# Altium project SVPX_FMC_6U_SOM.PrjPcb (part 5 of 5)

## Sheet LVDS_Splitter.SchDoc
size A3; Organization: Altium Limited; Address1: L3, 12a Rodborough Rd; Address2: Frenchs Forest; Address3: NSW; Address4: Australia 2086
Used 2 times, as channels U_LVDS_Splitter, U_LVDS_Splitter. Parts and nets are listed once, with the designators drawn on the sheet.
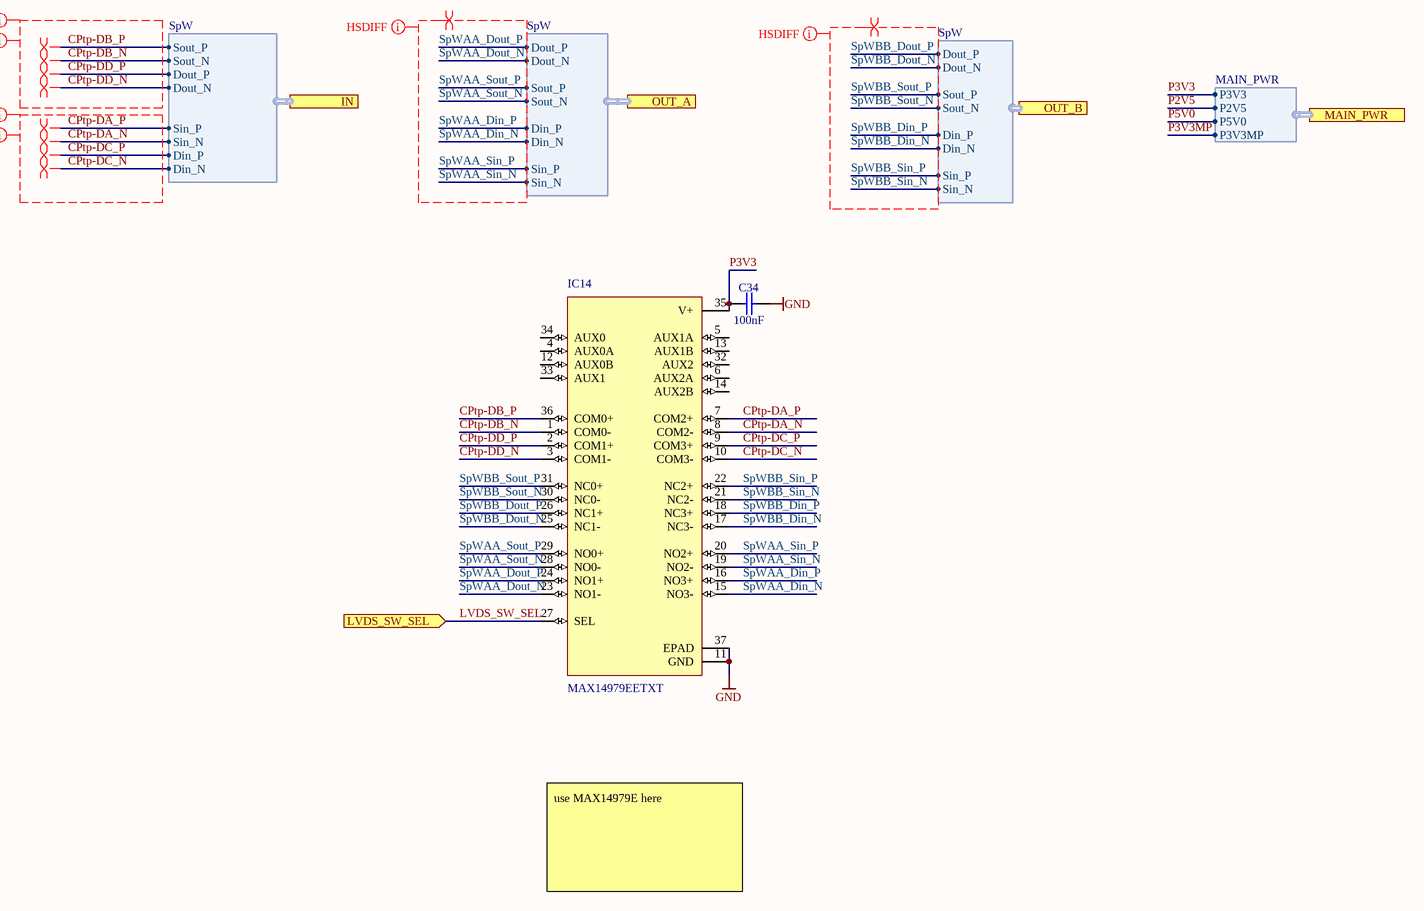
[diagram p17: LVDS_Splitter.SchDoc]

### Parts
C34  100nF  [CAPC0603X33N]
IC14  MAX14979EETXT  [QFN50P600X600X90-37N-S425]

### Ports
IN (harness SpW), LVDS_SW_SEL (in), MAIN_PWR (harness MAIN_PWR), OUT_A (harness SpW), OUT_B (harness SpW)

### Harnesses
MAIN_PWR: P3V3, P2V5, P5V0, P3V3MP
SpW: Sout_P, Sout_N, Dout_P, Dout_N, Sin_P, Sin_N, Din_P, Din_N

### Nets
GND: C34.2 IC14.11(GND) IC14.37(EPAD)
CPtp-DA_N: IC14.8(COM2-) ; port IN.Sin_N
CPtp-DA_P: IC14.7(COM2+) ; port IN.Sin_P
CPtp-DB_N: IC14.1(COM0-) ; port IN.Sout_N
CPtp-DB_P: IC14.36(COM0+) ; port IN.Sout_P
CPtp-DC_N: IC14.10(COM3-) ; port IN.Din_N
CPtp-DC_P: IC14.9(COM3+) ; port IN.Din_P
CPtp-DD_N: IC14.3(COM1-) ; port IN.Dout_N
CPtp-DD_P: IC14.2(COM1+) ; port IN.Dout_P
LVDS_SW_SEL: IC14.27(SEL) ; port LVDS_SW_SEL
P2V5: port MAIN_PWR.P2V5
P3V3: C34.1 IC14.35(V+) ; port MAIN_PWR.P3V3
P3V3MP: port MAIN_PWR.P3V3MP
P5V0: port MAIN_PWR.P5V0
SpWAA_Din_N: IC14.15(NO3-) ; port OUT_A.Din_N
SpWAA_Din_P: IC14.16(NO3+) ; port OUT_A.Din_P
SpWAA_Dout_N: IC14.23(NO1-) ; port OUT_A.Dout_N
SpWAA_Dout_P: IC14.24(NO1+) ; port OUT_A.Dout_P
SpWAA_Sin_N: IC14.19(NO2-) ; port OUT_A.Sin_N
SpWAA_Sin_P: IC14.20(NO2+) ; port OUT_A.Sin_P
SpWAA_Sout_N: IC14.28(NO0-) ; port OUT_A.Sout_N
SpWAA_Sout_P: IC14.29(NO0+) ; port OUT_A.Sout_P
SpWBB_Din_N: IC14.17(NC3-) ; port OUT_B.Din_N
SpWBB_Din_P: IC14.18(NC3+) ; port OUT_B.Din_P
SpWBB_Dout_N: IC14.25(NC1-) ; port OUT_B.Dout_N
SpWBB_Dout_P: IC14.26(NC1+) ; port OUT_B.Dout_P
SpWBB_Sin_N: IC14.21(NC2-) ; port OUT_B.Sin_N
SpWBB_Sin_P: IC14.22(NC2+) ; port OUT_B.Sin_P
SpWBB_Sout_N: IC14.30(NC0-) ; port OUT_B.Sout_N
SpWBB_Sout_P: IC14.31(NC0+) ; port OUT_B.Sout_P

Not connected (* = marked no-connect by the designer): IC14 4(AUX0A) 5(AUX1A) 6(AUX2A) 12(AUX0B) 13(AUX1B) 14(AUX2B) 32(AUX2) 33(AUX1) 34(AUX0)

### Channels
U_LVDS_Splitter: designators end in A; ports LVDS_SW_SEL=LVDS_SW_SEL
U_LVDS_Splitter: designators end in B; ports LVDS_SW_SEL=LVDS_SW_SEL

### Layout directives
differential pair: CPtp-DA_N, CPtp-DA_P, CPtp-DB_N, CPtp-DB_P, CPtp-DC_N, CPtp-DC_P, CPtp-DD_N, CPtp-DD_P, SpWAA_Din_N, SpWAA_Din_P, SpWAA_Dout_N, SpWAA_Dout_P, SpWAA_Sin_N, SpWAA_Sin_P, SpWAA_Sout_N, SpWAA_Sout_P, SpWBB_Din_N, SpWBB_Din_P, SpWBB_Dout_N, SpWBB_Dout_P, SpWBB_Sin_N, SpWBB_Sin_P, SpWBB_Sout_N, SpWBB_Sout_P
net class SpW_02_out: CPtp-DB_N, CPtp-DB_P, CPtp-DD_N, CPtp-DD_P
net class SpW_02_in: CPtp-DA_N, CPtp-DA_P, CPtp-DC_N, CPtp-DC_P
net class HSDIFF: CPtp-DA_N, CPtp-DA_P, CPtp-DB_N, CPtp-DB_P, CPtp-DC_N, CPtp-DC_P, CPtp-DD_N, CPtp-DD_P, SpWAA_Din_N, SpWAA_Din_P, SpWAA_Dout_N, SpWAA_Dout_P, SpWAA_Sin_N, SpWAA_Sin_P, SpWAA_Sout_N, SpWAA_Sout_P, SpWBB_Din_N, SpWBB_Din_P, SpWBB_Dout_N, SpWBB_Dout_P, SpWBB_Sin_N, SpWBB_Sin_P, SpWBB_Sout_N, SpWBB_Sout_P

### Notes on the sheet
- use MAX14979E here
- Title
- Size:
- Date:
- A3
- Number:
- Time:
- Revision:
- Sheet
- of
- File:

### Library data of the parts
C34 = CC0201_100NF_6.3V_10%_X5R: Non-polarised capacitor; Manufacturer: GENERIC; Part Description: SMD Multilayer Chip Ceramic Capacitor; Manufacturer1 Part Number: 02016D104KAT2A; Tolerance: ±10%; Voltage: 6.3V; TC: X5R; Part Number: CC0201_100NF_6.3V_10%_X5R; Component Kind: Standard; Component Type: Standard; Pin Count: 2; Value: 100nF; Status: Not Recommended; Manufacturer Part Number: CC0201_100NF_6.3V_10%_X5R; Case: 0201; Mounted: Yes; Socket: No; SMD: Yes; Sense: No; Manufacturer1 Example: AVX; Manufacturer1 ComponentHeight: 0.33mm; HelpURL: \\cern.ch\dfs\Applications\Altium\Datasheets\CC0201_X5R_AVX.pdf; Author: CERN DEM JLC; CreateDate: 03/12/2007; LatestRevisionDate: 03/12/2007
IC14 = MAX14979EETXT: IC SWITCH HIGH BW LVDS 36TQFN; MF: Maxim Integrated; MP: MAX14979EETX+; SnapEDA_Link: https://www.snapeda.com/parts/MAX14979EETX%2B/Maxim%20Integrated/view-part/?ref=snap; Price: None; Package: QFN-36 Maxim; Availability: Unavailable; Value: *

## Sheet MISC_Protection.SchDoc
size A4
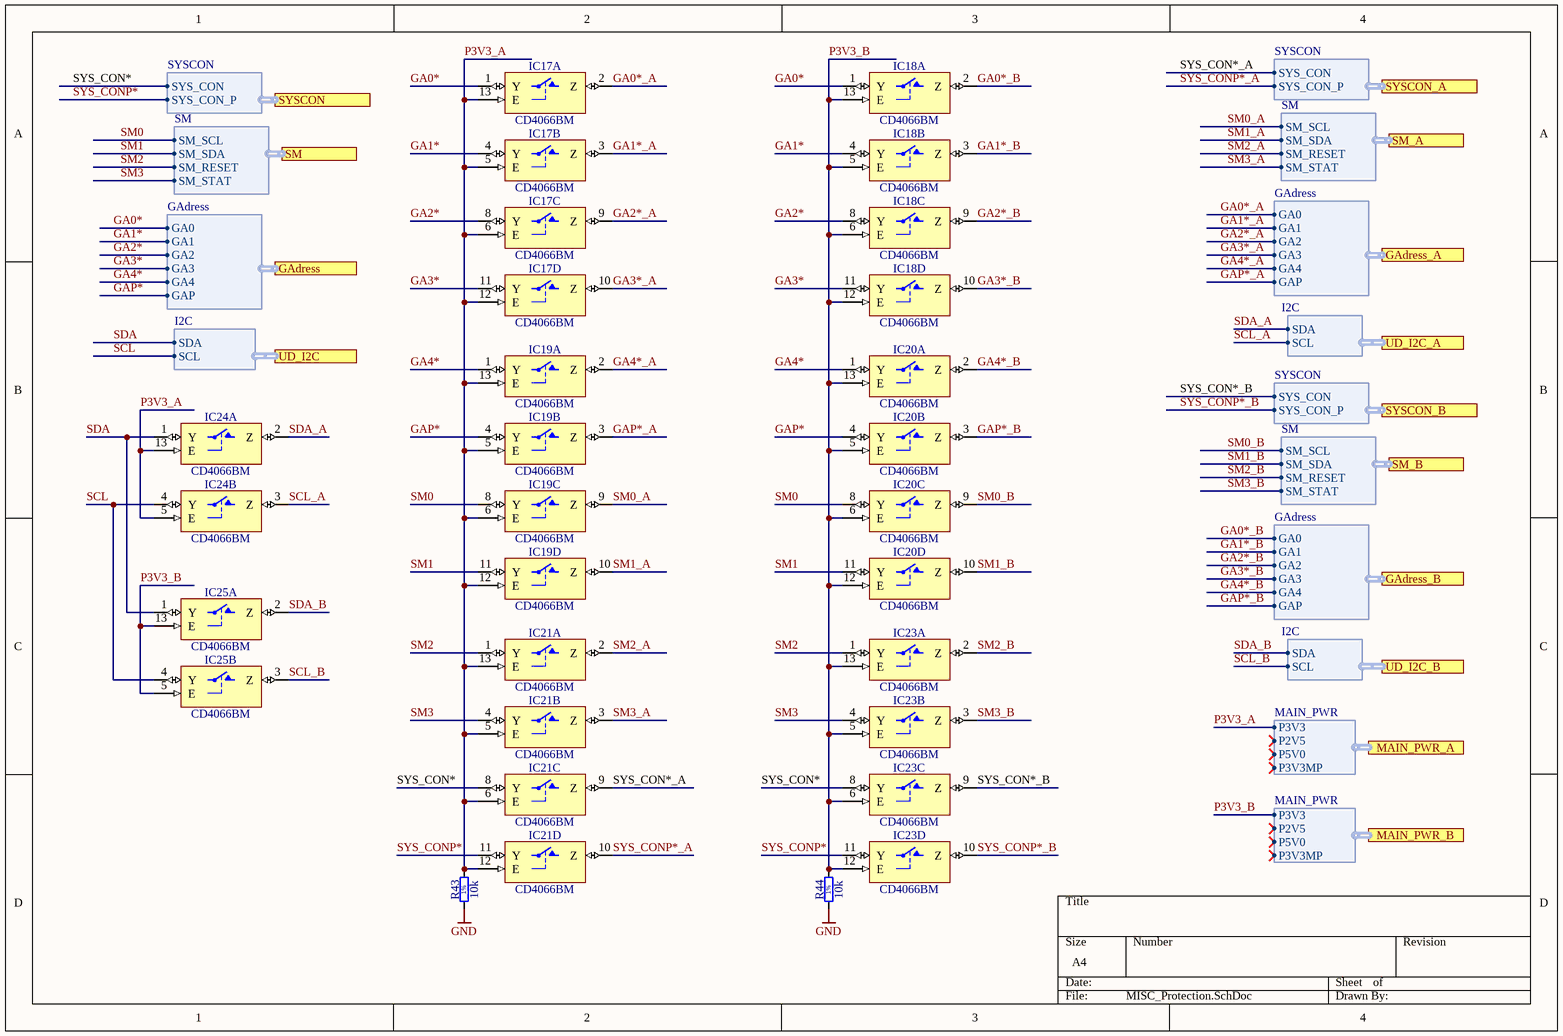
[diagram p18: MISC_Protection.SchDoc]

### Parts
IC17  CD4066BM  [SOIC127P600X175-14N]  (parts A,B,C,D of 4)
IC18  CD4066BM  [SOIC127P600X175-14N]  (parts A,B,C,D of 4)
IC19  CD4066BM  [SOIC127P600X175-14N]  (parts A,B,C,D of 4)
IC20  CD4066BM  [SOIC127P600X175-14N]  (parts A,B,C,D of 4)
IC21  CD4066BM  [SOIC127P600X175-14N]  (parts A,B,C,D of 4)
IC23  CD4066BM  [SOIC127P600X175-14N]  (parts A,B,C,D of 4)
IC24  CD4066BM  [SOIC127P600X175-14N]  (parts A,B of 4)
IC25  CD4066BM  [SOIC127P600X175-14N]  (parts A,B of 4)
R43  10k  [RESC1005X40N]
R44  10k  [RESC1005X40N]

### Ports
GAdress (harness GAdress), GAdress_A (harness GAdress), GAdress_B (harness GAdress), MAIN_PWR_A (harness MAIN_PWR), MAIN_PWR_B (harness MAIN_PWR), SM (harness SM), SM_A (harness SM), SM_B (harness SM), SYSCON (harness SYSCON), SYSCON_A (harness SYSCON), SYSCON_B (harness SYSCON), UD_I2C (harness I2C), UD_I2C_A (harness I2C), UD_I2C_B (harness I2C)

### Harnesses
SYSCON: SYS_CON, SYS_CON_P
SM: SM_SCL, SM_SDA, SM_RESET, SM_STAT
GAdress: GA0, GA1, GA2, GA3, GA4, GAP
MAIN_PWR: P3V3, P2V5, P5V0, P3V3MP
I2C: SDA, SCL

### Nets
GND: IC17.7(VSS) IC18.7(VSS) IC19.7(VSS) IC20.7(VSS) IC21.7(VSS) IC23.7(VSS) IC24.7(VSS) IC25.7(VSS) R43.1 R44.1
VDD: IC17.14(VDD) IC18.14(VDD) IC19.14(VDD) IC20.14(VDD) IC21.14(VDD) IC23.14(VDD) IC24.14(VDD) IC25.14(VDD)
GA0*: IC17.1(Y) IC18.1(Y) ; port GAdress.GA0
GA0*_A: IC17.2(Z) ; port GAdress_A.GA0  [project net GA0]
GA0*_B: IC18.2(Z) ; port GAdress_B.GA0  [project net GA0]
GA1*: IC17.4(Y) IC18.4(Y) ; port GAdress.GA1
GA1*_A: IC17.3(Z) ; port GAdress_A.GA1  [project net GA1]
GA1*_B: IC18.3(Z) ; port GAdress_B.GA1  [project net GA1]
GA2*: IC17.8(Y) IC18.8(Y) ; port GAdress.GA2
GA2*_A: IC17.9(Z) ; port GAdress_A.GA2  [project net GA2]
GA2*_B: IC18.9(Z) ; port GAdress_B.GA2  [project net GA2]
GA3*: IC17.11(Y) IC18.11(Y) ; port GAdress.GA3
GA3*_A: IC17.10(Z) ; port GAdress_A.GA3  [project net GA3]
GA3*_B: IC18.10(Z) ; port GAdress_B.GA3  [project net GA3]
GA4*: IC19.1(Y) IC20.1(Y) ; port GAdress.GA4
GA4*_A: IC19.2(Z) ; port GAdress_A.GA4  [project net GA4]
GA4*_B: IC20.2(Z) ; port GAdress_B.GA4  [project net GA4]
GAP*: IC19.4(Y) IC20.4(Y) ; port GAdress.GAP
GAP*_A: IC19.3(Z) ; port GAdress_A.GAP  [project net GAP]
GAP*_B: IC20.3(Z) ; port GAdress_B.GAP  [project net GAP]
P3V3_A: IC17.5(E) IC17.6(E) IC17.12(E) IC17.13(E) IC19.5(E) IC19.6(E) IC19.12(E) IC19.13(E) IC21.5(E) IC21.6(E) IC21.12(E) IC21.13(E) IC24.5(E) IC24.13(E) R43.2 ; port MAIN_PWR_A.P3V3  [project net MAIN_PWR.P3V3]
P3V3_B: IC18.5(E) IC18.6(E) IC18.12(E) IC18.13(E) IC20.5(E) IC20.6(E) IC20.12(E) IC20.13(E) IC23.5(E) IC23.6(E) IC23.12(E) IC23.13(E) IC25.5(E) IC25.13(E) R44.2 ; port MAIN_PWR_B.P3V3  [project net MAIN_PWR.P3V3]
SCL: IC24.4(Y) IC25.4(Y) ; port UD_I2C.SCL
SCL_A: IC24.3(Z) ; port UD_I2C_A.SCL
SCL_B: IC25.3(Z) ; port UD_I2C_B.SCL
SDA: IC24.1(Y) IC25.1(Y) ; port UD_I2C.SDA
SDA_A: IC24.2(Z) ; port UD_I2C_A.SDA
SDA_B: IC25.2(Z) ; port UD_I2C_B.SDA
SM0: IC19.8(Y) IC20.8(Y) ; port SM.SM_SCL
SM0_A: IC19.9(Z) ; port SM_A.SM_SCL
SM0_B: IC20.9(Z) ; port SM_B.SM_SCL
SM1: IC19.11(Y) IC20.11(Y) ; port SM.SM_SDA
SM1_A: IC19.10(Z) ; port SM_A.SM_SDA
SM1_B: IC20.10(Z) ; port SM_B.SM_SDA
SM2: IC21.1(Y) IC23.1(Y) ; port SM.SM_RESET
SM2_A: IC21.2(Z) ; port SM_A.SM_RESET
SM2_B: IC23.2(Z) ; port SM_B.SM_RESET
SM3: IC21.4(Y) IC23.4(Y) ; port SM.SM_STAT
SM3_A: IC21.3(Z) ; port SM_A.SM_STAT
SM3_B: IC23.3(Z) ; port SM_B.SM_STAT
SYS_CON*: IC21.8(Y) IC23.8(Y) ; port SYSCON.SYS_CON
SYS_CON*_A: IC21.9(Z) ; port SYSCON_A.SYS_CON  [project net SYS_CON]
SYS_CON*_B: IC23.9(Z) ; port SYSCON_B.SYS_CON  [project net SYS_CON]
SYS_CONP*: IC21.11(Y) IC23.11(Y) ; port SYSCON.SYS_CON_P
SYS_CONP*_A: IC21.10(Z) ; port SYSCON_A.SYS_CON_P  [project net SYS_CON_P]
SYS_CONP*_B: IC23.10(Z) ; port SYSCON_B.SYS_CON_P  [project net SYS_CON_P]

### Notes on the sheet
- (in symbol R0402_10K_1%_0.0625W_100PPM) 1%

### Library data of the parts
IC17-IC21 IC23-IC25 = CD4066BM: Part Description: CMOS Quad Bilateral Switch; Manufacturer: TEXAS INSTRUMENTS; PressFit: No; Bonding: No; Part Number: CD4066BM; Component Kind: Standard; Component Type: Standard; Device: CD4066BM; PackageDescription: SOIC 14, Pitch 1.27mm - Body 4x8.75mm, IPC Medium Density; Manufacturer Part Number: CD4066BM; Pin Count: 14; Case: SOIC14; Mounted: Yes; Socket: No; SMD: Yes; Sense: No; ComponentHeight: 1.75mm; Author: CERN DEM MR; HelpURL: \\cern.ch\dfs\Applications\Altium\Datasheets\CD4066BM.pdf; CreateDate: 21.01.2016; LatestRevisionDate: 21.01.2016
R43 R44 = R0402_10K_1%_0.0625W_100PPM: Resistor - 1%; Part Description: General Purpose Thick Film Chip Resistor; Manufacturer: GENERIC; Manufacturer1 Part Number: 232270671003L; TC: ±100ppm/°C; PressFit: No; Part Number: R0402_10K_1%_0.0625W_100PPM; Component Kind: Standard; Component Type: Standard; Pin Count: 2; Value: 10k; Status: Not Recommended; Power: 0.0625W; Tolerance: ±1%; Manufacturer Part Number: R0402_10K_1%_0.0625W_100PPM; Case: 0402; Mounted: Yes; Sense: No; Socket: No; SMD: Yes; Manufacturer1 Example: YAGEO PHYCOMP; Manufacturer1 ComponentHeight: 0.4mm; HelpURL: \\cern.ch\dfs\Applications\Altium\Datasheets\R0402_Phycomp_RC0402.pdf; Author: CERN DEM JLC; CreateDate: 03/12/2007; LatestRevisionDate: 17/10/2012

## Nets that join several sheets
3.3V_AUX: Supply for FPGA, FMC and SDRAM (C204A.2 IC2A.3 IC2A.4 R64A.1), SLT3-PAY-1Q2T_P0 (C174.2 P0.D5), Supply for FPGA, FMC and SDRAM (C204B.2 IC2B.3 IC2B.4 R64B.1)
GND: SVPXFMC_Carrier_6U_SOM (8 pins), Interface_prot_A (C2A.2 C230A.2 IC1A.11), U_FMC_connector (175 pins), Supply for FPGA, FMC and SDRAM (85 pins), SLT3-PAY-1Q2T_P0 (14 pins), SLT3-PAY-1Q2T_P1 (41 pins), U_management (12 pins), U_management/U_NIC_MSP430_power_jtag (17 pins), WR_OSC (17 pins), SoM (60 pins), U_FPGA_Config (13 pins), Interface_prot_A (C2B.2 C230B.2 IC1B.11), U_FMC_connector (176 pins), Supply for FPGA, FMC and SDRAM (85 pins), U_management (12 pins), U_management/U_NIC_MSP430_power_jtag (17 pins), WR_OSC (17 pins), SoM (60 pins), U_FPGA_Config (13 pins), U_LVDS_Splitter (C34A.2 IC14A.11 IC14A.37), U_LVDS_Splitter (C34B.2 IC14B.11 IC14B.37), MISC_Protection (10 pins)
P3V3_buck: Supply for FPGA, FMC and SDRAM (10 pins), Supply for FPGA, FMC and SDRAM (10 pins)
P12V0_IN: Supply for FPGA, FMC and SDRAM (C74A.2 IC4A.3 IC6A.1 IC9A.1), Supply for FPGA, FMC and SDRAM (C74B.2 IC4B.3 IC6B.1 IC9B.1)
3P3V: U_FMC_connector (8 pins), Supply for FPGA, FMC and SDRAM (L10A.2)
3P3V: U_FMC_connector (8 pins), Supply for FPGA, FMC and SDRAM (L10B.2)
3P3VAUX: U_FMC_connector (C193A.2 J2A.d32), Supply for FPGA, FMC and SDRAM (L3A.2)
3P3VAUX: U_FMC_connector (C193B.2 J2B.d32), Supply for FPGA, FMC and SDRAM (L3B.2)
12P0V: U_FMC_connector (5 pins), Supply for FPGA, FMC and SDRAM (L8A.2)
12P0V: U_FMC_connector (5 pins), Supply for FPGA, FMC and SDRAM (L8B.2)
CPtp-DA_N: SLT3-PAY-1Q2T_P1 (P1.B13), U_LVDS_Splitter (IC14B.8)
CPtp-DA_N: SLT3-PAY-1Q2T_P1 (P1.B15), U_LVDS_Splitter (IC14A.8)
CPtp-DA_P: SLT3-PAY-1Q2T_P1 (P1.A13), U_LVDS_Splitter (IC14B.7)
CPtp-DA_P: SLT3-PAY-1Q2T_P1 (P1.A15), U_LVDS_Splitter (IC14A.7)
CPtp-DB_N: SLT3-PAY-1Q2T_P1 (P1.E13), U_LVDS_Splitter (IC14B.1)
CPtp-DB_N: SLT3-PAY-1Q2T_P1 (P1.E15), U_LVDS_Splitter (IC14A.1)
CPtp-DB_P: SLT3-PAY-1Q2T_P1 (P1.D13), U_LVDS_Splitter (IC14B.36)
CPtp-DB_P: SLT3-PAY-1Q2T_P1 (P1.D15), U_LVDS_Splitter (IC14A.36)
CPtp-DC_N: SLT3-PAY-1Q2T_P1 (P1.C14), U_LVDS_Splitter (IC14B.10)
CPtp-DC_N: SLT3-PAY-1Q2T_P1 (P1.C16), U_LVDS_Splitter (IC14A.10)
CPtp-DC_P: SLT3-PAY-1Q2T_P1 (P1.B14), U_LVDS_Splitter (IC14B.9)
CPtp-DC_P: SLT3-PAY-1Q2T_P1 (P1.B16), U_LVDS_Splitter (IC14A.9)
CPtp-DD_N: SLT3-PAY-1Q2T_P1 (P1.F14), U_LVDS_Splitter (IC14B.3)
CPtp-DD_N: SLT3-PAY-1Q2T_P1 (P1.F16), U_LVDS_Splitter (IC14A.3)
CPtp-DD_P: SLT3-PAY-1Q2T_P1 (P1.E14), U_LVDS_Splitter (IC14B.2)
CPtp-DD_P: SLT3-PAY-1Q2T_P1 (P1.E16), U_LVDS_Splitter (IC14A.2)
DIS_LVDS: Supply for FPGA, FMC and SDRAM (R85A.2 T3A.3), SoM (5 pins)
DIS_LVDS: Supply for FPGA, FMC and SDRAM (R85B.2 T3B.3), SoM (5 pins)
EN_IFC: Interface_prot_A (IC1A.10), Supply for FPGA, FMC and SDRAM (D7A.2 R110A.1)
EN_IFC: Interface_prot_A (IC1B.10), Supply for FPGA, FMC and SDRAM (D7B.2 R110B.1)
EXT_RST_1: U_management (IC31A#1.53), U_FPGA_Config (C206A.2)
EXT_RST_1: U_management (IC31B#1.53), U_FPGA_Config (C206B.2)
FMC_P12V0_MSP430: Supply for FPGA, FMC and SDRAM (R63A.1), U_management (IC31A#1.36)
FMC_P12V0_MSP430: Supply for FPGA, FMC and SDRAM (R63B.1), U_management (IC31B#1.36)
FMC_P12V0_ONn: Supply for FPGA, FMC and SDRAM (IC9A.4 R63A.2 R83A.2), SoM (JB1A.100)
FMC_P12V0_ONn: Supply for FPGA, FMC and SDRAM (IC9B.4 R63B.2 R83B.2), SoM (JB1B.100)
FMC_P12V0_OVCn: Supply for FPGA, FMC and SDRAM (IC9A.7 R81A.2), U_management (IC31A#1.58)
FMC_P12V0_OVCn: Supply for FPGA, FMC and SDRAM (IC9B.7 R81B.2), U_management (IC31B#1.58)
FMC_SCL: U_FMC_connector (J2A.c30), SoM (IC13A.20 R35A.1)
FMC_SCL: U_FMC_connector (J2B.c30), SoM (IC13B.20 R35B.1)
FMC_SDA: U_FMC_connector (J2A.c31), SoM (IC13A.18 R37A.1)
FMC_SDA: U_FMC_connector (J2B.c31), SoM (IC13B.18 R37B.1)
GA0: U_management (IC31A#1.44 R130A.1), MISC_Protection (IC18.2)
GA0: U_management (IC31B#1.44 R130B.1), MISC_Protection (IC17.2)
GA0*: SLT3-PAY-1Q2T_P0 (P0.A6), MISC_Protection (IC17.1 IC18.1)
GA1: U_management (IC31A#1.45 R131A.1), MISC_Protection (IC18.3)
GA1: U_management (IC31B#1.45 R131B.1), MISC_Protection (IC17.3)
GA1*: SLT3-PAY-1Q2T_P0 (P0.B6), MISC_Protection (IC17.4 IC18.4)
GA2: U_management (IC31A#1.46 R132A.1), MISC_Protection (IC18.9)
GA2: U_management (IC31B#1.46 R132B.1), MISC_Protection (IC17.9)
GA2*: SLT3-PAY-1Q2T_P0 (P0.F6), MISC_Protection (IC17.8 IC18.8)
GA3: U_management (IC31A#1.47 R133A.1), MISC_Protection (IC18.10)
GA3: U_management (IC31B#1.47 R133B.1), MISC_Protection (IC17.10)
GA3*: SLT3-PAY-1Q2T_P0 (P0.G6), MISC_Protection (IC17.11 IC18.11)
GA4: U_management (IC31A#1.48 R134A.1), MISC_Protection (IC20.2)
GA4: U_management (IC31B#1.48 R134B.1), MISC_Protection (IC19.2)
GA4*: SLT3-PAY-1Q2T_P0 (P0.F5), MISC_Protection (IC19.1 IC20.1)
GAP: U_management (IC31A#1.49 R135A.1), MISC_Protection (IC20.3)
GAP: U_management (IC31B#1.49 R135B.1), MISC_Protection (IC19.3)
GAP*: SLT3-PAY-1Q2T_P0 (P0.G5), MISC_Protection (IC19.4 IC20.4)
GBTCLK0_M2C_N: U_FMC_connector (J2A.d5), SoM (JB3A.33)
GBTCLK0_M2C_N: U_FMC_connector (J2B.d5), SoM (JB3B.33)
GBTCLK0_M2C_P: U_FMC_connector (J2A.d4), SoM (JB3A.31)
GBTCLK0_M2C_P: U_FMC_connector (J2B.d4), SoM (JB3B.31)
GPIO_A1: Interface_prot_A (IC1A.6), U_management (IC31A#1.41)
GPIO_A1: Interface_prot_A (IC1B.6), U_management (IC31B#1.41)
GPIO_A2: Interface_prot_A (IC1A.7), U_management (IC31A#1.42)
GPIO_A2: Interface_prot_A (IC1B.7), U_management (IC31B#1.42)
GPIO_A3: Interface_prot_A (IC1A.8), U_management (IC31A#1.43)
GPIO_A3: Interface_prot_A (IC1B.8), U_management (IC31B#1.43)
GPIO_A4: Interface_prot_A (IC1A.9), U_management (IC31A#1.35)
GPIO_A4: Interface_prot_A (IC1B.9), U_management (IC31B#1.35)
GPIO_S1: Interface_prot_A (IC1A.15), SoM (JB3A.38)
GPIO_S1: Interface_prot_A (IC1B.15), SoM (JB3B.38)
GPIO_S2: Interface_prot_A (IC1A.14), SoM (JB3A.40)
GPIO_S2: Interface_prot_A (IC1B.14), SoM (JB3B.40)
GPIO_S3: Interface_prot_A (IC1A.13), SoM (JB3A.42)
GPIO_S3: Interface_prot_A (IC1B.13), SoM (JB3B.42)
GPIO_S4: Interface_prot_A (IC1A.12), SoM (JB3A.44)
GPIO_S4: Interface_prot_A (IC1B.12), SoM (JB3B.44)
Helper_DCXO_N: WR_OSC (C195A.2 R122A.1 R127A.2), SoM (JB2A.22)
Helper_DCXO_N: WR_OSC (C195B.2 R122B.1 R127B.2), SoM (JB2B.22)
Helper_DCXO_OE: WR_OSC (R124A.1 R129A.1), SoM (JB3A.60)
Helper_DCXO_OE: WR_OSC (R124B.1 R129B.1), SoM (JB3B.60)
Helper_DCXO_P: WR_OSC (C194A.2 R123A.1 R128A.2), SoM (JB2A.24)
Helper_DCXO_P: WR_OSC (C194B.2 R123B.1 R128B.2), SoM (JB2B.24)
Helper_DCXO_SCL: WR_OSC (OSC2A.8 R121A.1 TP8A.1), SoM (JB3A.58 R33A.1)
Helper_DCXO_SCL: WR_OSC (OSC2B.8 R121B.1 TP8B.1), SoM (JB3B.58 R33B.1)
Helper_DCXO_SDA: WR_OSC (OSC2A.7 R120A.1 TP7A.1), SoM (JB3A.56 R31A.1)
Helper_DCXO_SDA: WR_OSC (OSC2B.7 R120B.1 TP7B.1), SoM (JB3B.56 R31B.1)
Imeas_P2V5: Supply for FPGA, FMC and SDRAM (C25A.2 IC7A.8 R26A.1), U_management (IC31A#1.31)
Imeas_P2V5: Supply for FPGA, FMC and SDRAM (C25B.2 IC7B.8 R26B.1), U_management (IC31B#1.31)
Imeas_P3V3: Supply for FPGA, FMC and SDRAM (C26A.2 IC7A.10 R27A.1), U_management (IC31A#1.29)
Imeas_P3V3: Supply for FPGA, FMC and SDRAM (C26B.2 IC7B.10 R27B.1), U_management (IC31B#1.29)
Imeas_P3V3MP: Supply for FPGA, FMC and SDRAM (C205A.2 R97A.1), U_management (IC31A#1.63)
Imeas_P3V3MP: Supply for FPGA, FMC and SDRAM (C205B.2 R97B.1), U_management (IC31B#1.63)
Imeas_P5V0: Supply for FPGA, FMC and SDRAM (C22A.2 IC7A.4 R47A.1), U_management (IC31A#1.17)
Imeas_P5V0: Supply for FPGA, FMC and SDRAM (C22B.2 IC7B.4 R47B.1), U_management (IC31B#1.17)
Imeas_P12V0: Supply for FPGA, FMC and SDRAM (C75A.2 R45A.1), U_management (IC31A#1.30)
Imeas_P12V0: Supply for FPGA, FMC and SDRAM (C75B.2 R45B.1), U_management (IC31B#1.30)
LVDS_SW_SEL: U_management (IC31A#1.12), U_LVDS_Splitter (IC14B.27)
LVDS_SW_SEL: U_management (IC31B#1.12), U_LVDS_Splitter (IC14A.27)
Main_DCXO_N: WR_OSC (C182A.2 R104A.1 R113A.2), SoM (JB2A.58)
Main_DCXO_N: WR_OSC (C182B.2 R104B.1 R113B.2), SoM (JB2B.58)
Main_DCXO_OE: WR_OSC (R108A.1 R119A.1), SoM (JB3A.54)
Main_DCXO_OE: WR_OSC (R108B.1 R119B.1), SoM (JB3B.54)
Main_DCXO_P: WR_OSC (C178A.2 R105A.1 R114A.2), SoM (JB2A.56)
Main_DCXO_P: WR_OSC (C178B.2 R105B.1 R114B.2), SoM (JB2B.56)
Main_DCXO_SCL: WR_OSC (OSC1A.8 R103A.1 TP6A.1), SoM (JB3A.52 R32A.1)
Main_DCXO_SCL: WR_OSC (OSC1B.8 R103B.1 TP6B.1), SoM (JB3B.52 R32B.1)
Main_DCXO_SDA: WR_OSC (OSC1A.7 R98A.1 TP5A.1), SoM (JB3A.50 R6A.1)
Main_DCXO_SDA: WR_OSC (OSC1B.7 R98B.1 TP5B.1), SoM (JB3B.50 R6B.1)
MAIN_PWR.P2V5: Interface_prot_A (C2A.1 IC1A.19), Supply for FPGA, FMC and SDRAM (5 pins), WR_OSC (R104A.2 R105A.2 R122A.2 R123A.2), SoM (20 pins)
MAIN_PWR.P2V5: Interface_prot_A (C2B.1 IC1B.19), Supply for FPGA, FMC and SDRAM (5 pins), WR_OSC (R104B.2 R105B.2 R122B.2 R123B.2), SoM (20 pins)
MAIN_PWR.P3V3: Supply for FPGA, FMC and SDRAM (9 pins), WR_OSC (L12A.1 L13A.1 R86A.1), SoM (9 pins), U_FPGA_Config (5 pins), U_LVDS_Splitter (C34B.1 IC14B.35), MISC_Protection (15 pins)
MAIN_PWR.P3V3: Supply for FPGA, FMC and SDRAM (9 pins), WR_OSC (L12B.1 L13B.1 R86B.1), SoM (9 pins), U_FPGA_Config (5 pins), U_LVDS_Splitter (C34A.1 IC14A.35), MISC_Protection (15 pins)
MAIN_PWR.P3V3MP: Interface_prot_A (C230A.1 IC1A.2), Supply for FPGA, FMC and SDRAM (6 pins), U_management (18 pins), U_management/U_NIC_MSP430_power_jtag (11 pins), SoM (IC13A.19)
MAIN_PWR.P3V3MP: Interface_prot_A (C230B.1 IC1B.2), Supply for FPGA, FMC and SDRAM (6 pins), U_management (18 pins), U_management/U_NIC_MSP430_power_jtag (11 pins), SoM (IC13B.19)
MAIN_PWR.P5V0: Supply for FPGA, FMC and SDRAM (IC5A.5 R20A.2 R24A.2 TP10A.1), SoM (9 pins), U_FPGA_Config (6 pins)
MAIN_PWR.P5V0: Supply for FPGA, FMC and SDRAM (IC5B.5 R20B.2 R24B.2 TP10B.1), SoM (9 pins), U_FPGA_Config (6 pins)
NetIC1A_1: Interface_prot_A (IC1A.1), U_management (IC31A#1.66)
NetIC1A_3: Interface_prot_A (IC1A.3), U_management (IC31A#1.65)
NetIC1A_4: Interface_prot_A (IC1A.4), U_management (IC31A#1.67)
NetIC1A_5: Interface_prot_A (IC1A.5), U_management (IC31A#1.68)
NetIC1B_1: Interface_prot_A (IC1B.1), U_management (IC31B#1.66)
NetIC1B_3: Interface_prot_A (IC1B.3), U_management (IC31B#1.65)
NetIC1B_4: Interface_prot_A (IC1B.4), U_management (IC31B#1.67)
NetIC1B_5: Interface_prot_A (IC1B.5), U_management (IC31B#1.68)
PG_P2V5: Supply for FPGA, FMC and SDRAM (D6A.1 R76A.1 R194A.2 U6A.15), U_management (IC31A#1.6)
PG_P2V5: Supply for FPGA, FMC and SDRAM (D6B.1 R76B.1 R194B.2 U6B.15), U_management (IC31B#1.6)
PG_P3V3: Supply for FPGA, FMC and SDRAM (D17A.1 R94A.1 R193A.2 U7A.15), U_management (IC31A#1.57)
PG_P3V3: Supply for FPGA, FMC and SDRAM (D17B.1 R94B.1 R193B.2 U7B.15), U_management (IC31B#1.57)
PG_P5V0: Supply for FPGA, FMC and SDRAM (R58A.1 R60A.1 R195A.2 U1A.15), U_management (IC31A#1.4)
PG_P5V0: Supply for FPGA, FMC and SDRAM (R58B.1 R60B.1 R195B.2 U1B.15), U_management (IC31B#1.4)
PWR_OVLn: Supply for FPGA, FMC and SDRAM (7 pins), U_management (IC31A#1.15)
PWR_OVLn: Supply for FPGA, FMC and SDRAM (7 pins), U_management (IC31B#1.15)
RxD: U_management (IC31A#1.9), U_management/U_NIC_MSP430_power_jtag (R146A.2)
RxD: U_management (IC31B#1.9), U_management/U_NIC_MSP430_power_jtag (R146B.2)
SM0: SLT3-PAY-1Q2T_P0 (D21.2 P0.B5), MISC_Protection (IC19.8 IC20.8)
SM0_A: U_management (IC31B#1.52 R161B.2), MISC_Protection (IC19.9)
SM0_B: U_management (IC31A#1.52 R161A.2), MISC_Protection (IC20.9)
SM1: SLT3-PAY-1Q2T_P0 (D21.1 P0.A5), MISC_Protection (IC19.11 IC20.11)
SM1_A: U_management (IC31B#1.51 R160B.2), MISC_Protection (IC19.10)
SM1_B: U_management (IC31A#1.51 R160A.2), MISC_Protection (IC20.10)
SM2: SLT3-PAY-1Q2T_P0 (D16.1 P0.G4), MISC_Protection (IC21.1 IC23.1)
SM2_A: U_management/U_NIC_MSP430_power_jtag (C173B.2), MISC_Protection (IC21.2)
SM2_B: U_management/U_NIC_MSP430_power_jtag (C173A.2), MISC_Protection (IC23.2)
SM3: SLT3-PAY-1Q2T_P0 (D16.2 P0.F4), MISC_Protection (IC21.4 IC23.4)
SM3_A: U_management (IC31B#1.56), MISC_Protection (IC21.3)
SM3_B: U_management (IC31A#1.56), MISC_Protection (IC23.3)
SPI_S_MISO: Interface_prot_A (IC1A.20), SoM (JB1A.94)
SPI_S_MISO: Interface_prot_A (IC1B.20), SoM (JB1B.94)
SPI_S_MOSI: Interface_prot_A (IC1A.18), SoM (JB1A.92)
SPI_S_MOSI: Interface_prot_A (IC1B.18), SoM (JB1B.92)
SPI_S_SCK: Interface_prot_A (IC1A.17), SoM (JB1A.88)
SPI_S_SCK: Interface_prot_A (IC1B.17), SoM (JB1B.88)
SPI_S_SS: Interface_prot_A (IC1A.16), SoM (JB1A.86)
SPI_S_SS: Interface_prot_A (IC1B.16), SoM (JB1B.86)
SpWA_Din_N: SoM (D13A.2 JB2A.33), U_LVDS_Splitter (IC14A.17)
SpWA_Din_N: SoM (D13B.2 JB2B.33), U_LVDS_Splitter (IC14A.15)
SpWA_Din_P: SoM (D13A.1 JB2A.31), U_LVDS_Splitter (IC14A.18)
SpWA_Din_P: SoM (D13B.1 JB2B.31), U_LVDS_Splitter (IC14A.16)
SpWA_Dout_N: SoM (JB1A.42), U_LVDS_Splitter (IC14A.25)
SpWA_Dout_N: SoM (JB1B.42), U_LVDS_Splitter (IC14A.23)
SpWA_Dout_P: SoM (JB1A.44), U_LVDS_Splitter (IC14A.26)
SpWA_Dout_P: SoM (JB1B.44), U_LVDS_Splitter (IC14A.24)
SpWA_Sin_N: SoM (D4A.2 JB2A.37), U_LVDS_Splitter (IC14A.21)
SpWA_Sin_N: SoM (D4B.2 JB2B.37), U_LVDS_Splitter (IC14A.19)
SpWA_Sin_P: SoM (D4A.1 JB2A.35), U_LVDS_Splitter (IC14A.22)
SpWA_Sin_P: SoM (D4B.1 JB2B.35), U_LVDS_Splitter (IC14A.20)
SpWA_Sout_N: SoM (JB1A.36), U_LVDS_Splitter (IC14A.30)
SpWA_Sout_N: SoM (JB1B.36), U_LVDS_Splitter (IC14A.28)
SpWA_Sout_P: SoM (JB1A.38), U_LVDS_Splitter (IC14A.31)
SpWA_Sout_P: SoM (JB1B.38), U_LVDS_Splitter (IC14A.29)
SpWAA_Din_N: SoM (D11B.2 JB3B.49), U_LVDS_Splitter (IC14B.15)
SpWAA_Din_P: SoM (D11B.1 JB3B.47), U_LVDS_Splitter (IC14B.16)
SpWAA_Dout_N: SoM (JB3B.43), U_LVDS_Splitter (IC14B.23)
SpWAA_Dout_P: SoM (JB3B.41), U_LVDS_Splitter (IC14B.24)
SpWAA_Sin_N: SoM (D8B.2 JB3B.53), U_LVDS_Splitter (IC14B.19)
SpWAA_Sin_P: SoM (D8B.1 JB3B.51), U_LVDS_Splitter (IC14B.20)
SpWAA_Sout_N: SoM (JB3B.39), U_LVDS_Splitter (IC14B.28)
SpWAA_Sout_P: SoM (JB3B.37), U_LVDS_Splitter (IC14B.29)
SpWB_Din_N: SoM (D11A.2 JB3A.49), U_LVDS_Splitter (IC14B.17)
SpWB_Din_P: SoM (D11A.1 JB3A.47), U_LVDS_Splitter (IC14B.18)
SpWB_Dout_N: SoM (JB3A.43), U_LVDS_Splitter (IC14B.25)
SpWB_Dout_P: SoM (JB3A.41), U_LVDS_Splitter (IC14B.26)
SpWB_Sin_N: SoM (D8A.2 JB3A.53), U_LVDS_Splitter (IC14B.21)
SpWB_Sin_P: SoM (D8A.1 JB3A.51), U_LVDS_Splitter (IC14B.22)
SpWB_Sout_N: SoM (JB3A.39), U_LVDS_Splitter (IC14B.30)
SpWB_Sout_P: SoM (JB3A.37), U_LVDS_Splitter (IC14B.31)
SYNC: Supply for FPGA, FMC and SDRAM (R4A.1 R17A.1 R25A.1), SoM (JB1A.96)
SYNC: Supply for FPGA, FMC and SDRAM (R4B.1 R17B.1 R25B.1), SoM (JB1B.96)
SYS_CON: U_management (D9A.4 IC31A#1.25), MISC_Protection (IC23.9)
SYS_CON: U_management (D9B.4 IC31B#1.25), MISC_Protection (IC21.9)
SYS_CON_P: U_management (D9A.3 IC31A#1.26), MISC_Protection (IC23.10)
SYS_CON_P: U_management (D9B.3 IC31B#1.26), MISC_Protection (IC21.10)
SYSRESET*: SLT3-PAY-1Q2T_P0 (P0.B4 TP26.1), U_FPGA_Config (C210A.2), U_FPGA_Config (C210B.2)
TxD: U_management (IC31A#1.8), U_management/U_NIC_MSP430_power_jtag (R145A.2)
TxD: U_management (IC31B#1.8), U_management/U_NIC_MSP430_power_jtag (R145B.2)
UD_I2C_SCL: SLT3-PAY-1Q2T_P1 (R153.2), SoM (IC13A.17 R39A.1), SoM (IC13B.17 R39B.1)
UD_I2C_SDA: SLT3-PAY-1Q2T_P1 (R152.2), SoM (IC13A.16 R41A.1), SoM (IC13B.16 R41B.1)
Umeas_P2V5: Supply for FPGA, FMC and SDRAM (C86A.2 R79A.2 R80A.2), U_management (IC31A#1.33)
Umeas_P2V5: Supply for FPGA, FMC and SDRAM (C86B.2 R79B.2 R80B.2), U_management (IC31B#1.33)
Umeas_P3V3: Supply for FPGA, FMC and SDRAM (C87A.2 R88A.1 R90A.2), U_management (IC31A#1.32)
Umeas_P3V3: Supply for FPGA, FMC and SDRAM (C87B.2 R88B.1 R90B.2), U_management (IC31B#1.32)
Umeas_P3V3MP: Supply for FPGA, FMC and SDRAM (C166A.2 R87A.2 R93A.2), U_management (IC31A#1.64)
Umeas_P3V3MP: Supply for FPGA, FMC and SDRAM (C166B.2 R87B.2 R93B.2), U_management (IC31B#1.64)
Umeas_P5V0: Supply for FPGA, FMC and SDRAM (C82A.2 R24A.1), U_management (IC31A#1.34)
Umeas_P5V0: Supply for FPGA, FMC and SDRAM (C82B.2 R24B.1), U_management (IC31B#1.34)
Umeas_P12V0: Supply for FPGA, FMC and SDRAM (C23A.2 R65A.2 R72A.2), U_management (IC31A#1.3)
Umeas_P12V0: Supply for FPGA, FMC and SDRAM (C23B.2 R65B.2 R72B.2), U_management (IC31B#1.3)
Umeas_P12V0IN: Supply for FPGA, FMC and SDRAM (C11A.2 R1A.2 R10A.2), U_management (IC31A#1.16)
Umeas_P12V0IN: Supply for FPGA, FMC and SDRAM (C11B.2 R1B.2 R10B.2), U_management (IC31B#1.16)
UTP01-RD0_N: SLT3-PAY-1Q2T_P1 (P1.B1), SoM (JB3B.7)
UTP01-RD0_N: SLT3-PAY-1Q2T_P1 (P1.B3), SoM (JB3A.7)
UTP01-RD0_P: SLT3-PAY-1Q2T_P1 (P1.A1), SoM (JB3B.9)
UTP01-RD0_P: SLT3-PAY-1Q2T_P1 (P1.A3), SoM (JB3A.9)
UTP01-TD0_N: SLT3-PAY-1Q2T_P1 (P1.E1), SoM (JB3B.8)
UTP01-TD0_N: SLT3-PAY-1Q2T_P1 (P1.E3), SoM (JB3A.8)
UTP01-TD0_P: SLT3-PAY-1Q2T_P1 (P1.D1), SoM (JB3B.10)
UTP01-TD0_P: SLT3-PAY-1Q2T_P1 (P1.D3), SoM (JB3A.10)
UTP02-RD0_N: SLT3-PAY-1Q2T_P1 (P1.C2), SoM (JB3B.13)
UTP02-RD0_N: SLT3-PAY-1Q2T_P1 (P1.C4), SoM (JB3A.13)
UTP02-RD0_P: SLT3-PAY-1Q2T_P1 (P1.B2), SoM (JB3B.15)
UTP02-RD0_P: SLT3-PAY-1Q2T_P1 (P1.B4), SoM (JB3A.15)
UTP02-TD0_N: SLT3-PAY-1Q2T_P1 (P1.F2), SoM (JB3B.14)
UTP02-TD0_N: SLT3-PAY-1Q2T_P1 (P1.F4), SoM (JB3A.14)
UTP02-TD0_P: SLT3-PAY-1Q2T_P1 (P1.E2), SoM (JB3B.16)
UTP02-TD0_P: SLT3-PAY-1Q2T_P1 (P1.E4), SoM (JB3A.16)
VADJ: U_FMC_connector (7 pins), Supply for FPGA, FMC and SDRAM (L9A.2)
VADJ: U_FMC_connector (7 pins), Supply for FPGA, FMC and SDRAM (L9B.2)
VIO_B_M2C: U_FMC_connector (J2A.j39 J2A.k40), Supply for FPGA, FMC and SDRAM (R156A.2)
VIO_B_M2C: U_FMC_connector (J2B.j39 J2B.k40), Supply for FPGA, FMC and SDRAM (R156B.2)

## Assembly variants
Default: not fitted R162 R163 R164 R165 R170 R171 R172 R173 R178 R179 R180 R181 R186 R187 R188 R189